# EAGLE design testbrd (EAGLE 6.6.0)
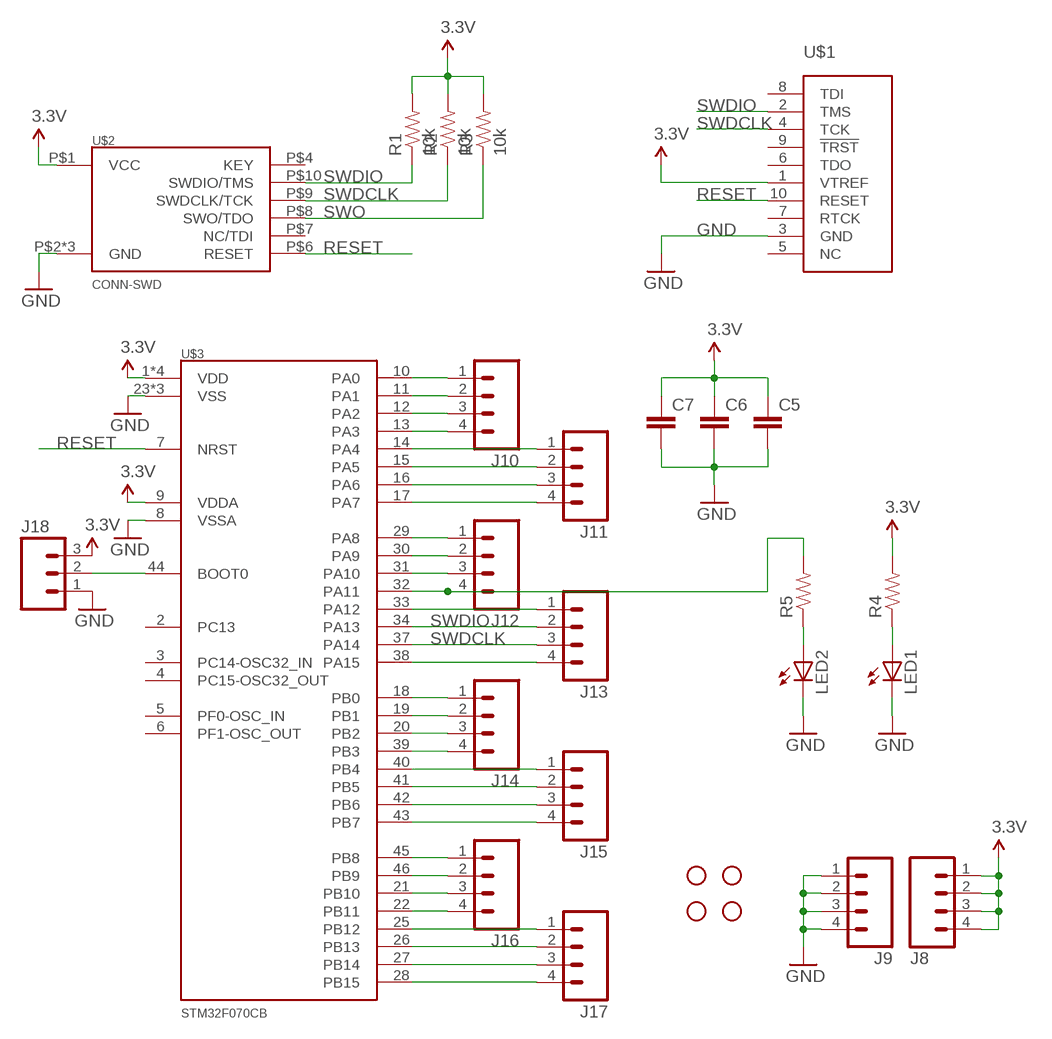
[diagram p0: schematic, sheet 1]

## Parts
C5  CAP0805  [0805]
C6  CAP0805  [0805]
C7  CAP0805  [0805]
H1  STAND-OFF  [STAND-OFF]
H2  STAND-OFF  [STAND-OFF]
H3  STAND-OFF  [STAND-OFF]
H4  STAND-OFF  [STAND-OFF]
J8  M04PTH  [1X04]
J9  M04PTH  [1X04]
J10  M04PTH  [1X04]
J11  M04PTH  [1X04]
J12  M04PTH  [1X04]
J13  M04PTH  [1X04]
J14  M04PTH  [1X04]
J15  M04PTH  [1X04]
J16  M04PTH  [1X04]
J17  M04PTH  [1X04]
J18  M03PTH  [1X03]
LED1  LEDCHIPLED_0805  [CHIPLED_0805]
LED2  LEDCHIPLED_0805  [CHIPLED_0805]
R1  10k  RESISTOR0805-RES  [0805]
R2  10k  RESISTOR0805-RES  [0805]
R3  10k  RESISTOR0805-RES  [0805]
R4  RESISTOR0805-RES  [0805]
R5  RESISTOR0805-RES  [0805]
U$1  TC2050-MCP-NL  [TC2050]
U$2  CONN-SWD  [CONN2X5]
U$3  STM32F070CB  [LQFP-48]

## Nets
3.3V: C5.1 C6.1 C7.1 J8.1 J8.2 J8.3 J8.4 J18.3 R1.2 R2.2 R3.2 R4.2 U$1.1(VTREF) U$2.P$1(VCC) U$3.1(VDD) U$3.9(VDDA) U$3.24(VDD) U$3.36(VDD) U$3.48(VDD)
GND: C5.2 C6.2 C7.2 J9.1 J9.2 J9.3 J9.4 J18.1 LED1.C LED2.C U$1.3(GND) U$2.P$2(GND) U$2.P$3(GND) U$2.P$5(GND) U$3.8(VSSA) U$3.23(VSS) U$3.35(VSS) U$3.47(VSS)
N$1: LED1.A R4.1
N$2: LED2.A R5.1
N$29: J18.2 U$3.44(BOOT0)
N$30: J10.1 U$3.10(PA0)
N$31: J10.2 U$3.11(PA1)
N$32: J10.3 U$3.12(PA2)
N$33: J10.4 U$3.13(PA3)
N$34: J11.1 U$3.14(PA4)
N$35: J11.2 U$3.15(PA5)
N$36: J11.3 U$3.16(PA6)
N$37: J11.4 U$3.17(PA7)
N$38: J12.1 U$3.29(PA8)
N$39: J12.2 U$3.30(PA9)
N$40: J12.3 U$3.31(PA10)
N$41: J12.4 R5.2 U$3.32(PA11)
N$42: J13.1 U$3.33(PA12)
N$45: J13.4 U$3.38(PA15)
N$46: J14.1 U$3.18(PB0)
N$47: J14.2 U$3.19(PB1)
N$48: J14.3 U$3.20(PB2)
N$49: J14.4 U$3.39(PB3)
N$50: J15.1 U$3.40(PB4)
N$51: J15.2 U$3.41(PB5)
N$52: J15.3 U$3.42(PB6)
N$53: J15.4 U$3.43(PB7)
N$54: J16.1 U$3.45(PB8)
N$55: J16.2 U$3.46(PB9)
N$56: J16.3 U$3.21(PB10)
N$57: J16.4 U$3.22(PB11)
N$58: J17.1 U$3.25(PB12)
N$59: J17.2 U$3.26(PB13)
N$60: J17.3 U$3.27(PB14)
N$61: J17.4 U$3.28(PB15)
RESET: U$1.10(RESET) U$2.P$6(RESET) U$3.7(NRST)
SWDCLK: J13.3 R2.1 U$1.4(TCK) U$2.P$9(SWDCLK/TCK) U$3.37(PA14)
SWDIO: J13.2 R1.1 U$1.2(TMS) U$2.P$10(SWDIO/TMS) U$3.34(PA13)
SWO: R3.1 U$2.P$8(SWO/TDO)
Unconnected: U$1.5(NC) U$1.6(TDO) U$1.7(RTCK) U$1.8(TDI) U$1.9(!TRST) U$2.P$4(KEY) U$2.P$7(NC/TDI) U$3.2(PC13) U$3.3(PC14-OSC32_IN) U$3.4(PC15-OSC32_OUT) U$3.5(PF0-OSC_IN) U$3.6(PF1-OSC_OUT)

## Library data of the parts
C5-C7 = SparkFun-Capacitors:CAP: Capacitor Standard 0603 ceramic capacitor, and 0.1" leaded capacitor.
H1-H4 = SparkFun-Electromechanical:STAND-OFF: #4 Stand Off This is the mechanical footprint for a #4 phillips button head screw. Use the keepout ring to avoid running the screw head into surrounding components. SKU : PRT-00447
J8-J17 = SparkFun-Connectors:M04: Header 4 Standard 4-pin 0.1" header. Use with straight break away headers (SKU : PRT-00116), right angle break away headers (PRT-00553), swiss pins (PRT-00743), machine pins (PRT-00117), and female headers (PRT-00115). Molex polarized connector foot print use with SKU : PRT-08231 with associated crimp pins and housings. 1MM SMD Version SKU: PRT-10208; PROD_ID: CONN-09696
J18 = SparkFun-Connectors:M03: Header 3 Standard 3-pin 0.1" header. Use with straight break away headers (SKU : PRT-00116), right angle break away headers (PRT-00553), swiss pins (PRT-00743), machine pins (PRT-00117), and female headers (PRT-00115). Molex polarized connector foot print use with SKU : PRT-08232 with associated crimp pins and housings.
LED1 LED2 = adafruit:LED: LED OSRAM: - CHIPLED LG R971, LG N971, LY N971, LG Q971, LY Q971, LO R971, LY R971 LH N974, LH R974 LS Q976, LO Q976, LY Q976 LO Q996 - Hyper CHIPLED LW Q18S LB Q993, LB Q99A, LB R99A - SideLED LS A670, LO A670, LY A670, LG A670, LP A670 LB A673, LV A673, LT A673, LW A673 LH A674 LY A675 LS A676, LA A676, LO A676, LY A676, LW A676 LS A679, LY A679, LG A679 - Hyper Micro SIDELED® LS Y876, LA Y876, LO Y876, LY Y876 LT Y87S - SmartLED LW L88C, LW L88S LB L89C, LB L89S, LG L890 LS L89K, LO L89K, LY L89K LS L896, LA L896, LO L896, LY L896 - TOPLED LS T670, LO T670, LY T670, LG T670, LP T670 LSG T670, LSP T670, LSY T670, LOP T670, LYG T670 LG T671, LOG T671, LSG T671 LB T673, LV T673, LT T673, LW T673 LH T674 LS T676, LA T676, LO T676, LY T676, LB T676, LH T676, LSB T676, LW T676 LB T67C, LV T67C, LT T67C, LS T67K, LO T67K, LY T67K, LW E67C LS E67B, LA E67B, LO E67B, LY E67B, LB E67C, LV E67C, LT E67C LW T67C LS T679, LY T679, LG T679 LS T770, LO T770, LY T770, LG T770, LP T770 LB T773, LV T773, LT T773, LW T773 LH T774 LS E675, LA E675, LY E675, LS T675 LS T776, LA T776, LO T776, LY T776, LB T776 LHGB T686 LT T68C, LB T68C - Hyper Mini TOPLED® LB M676 - Mini TOPLED Santana® LG M470 LS M47K, LO M47K, LY M47K Source: http://www.osram.convergy.de/
R1-R5 = SparkFun-Resistors:RESISTOR: Resistor Basic schematic elements and footprints for 0603, 1206, and PTH resistors.
U$1 = Connector:TC2050: TAG-CONNECT ISP Connector Manufacturer: Tag-Connect <www.tag-connect.com> Cable for easy In-Circuit PCB Programming. Designed for JTAG 10 pin, suitable for many others. Pin Connection for TC2050 NL. PAD Description 1 VTREF 2 TMS 3 GND 4 TCK 5 NC 6 TDO 7 RTCK 8 TDI 9 !TRST 10 RESET ©2009 ROFA.cz Modified 7/2011 by Tim McCarthy-Smith VIDA Products INC
U$2 = Atmel:CONN-SWD: 1.27mm pitch, 2x5 header for single wire debug / JTAG
U$3 = ST:STM32F070CB

## Board
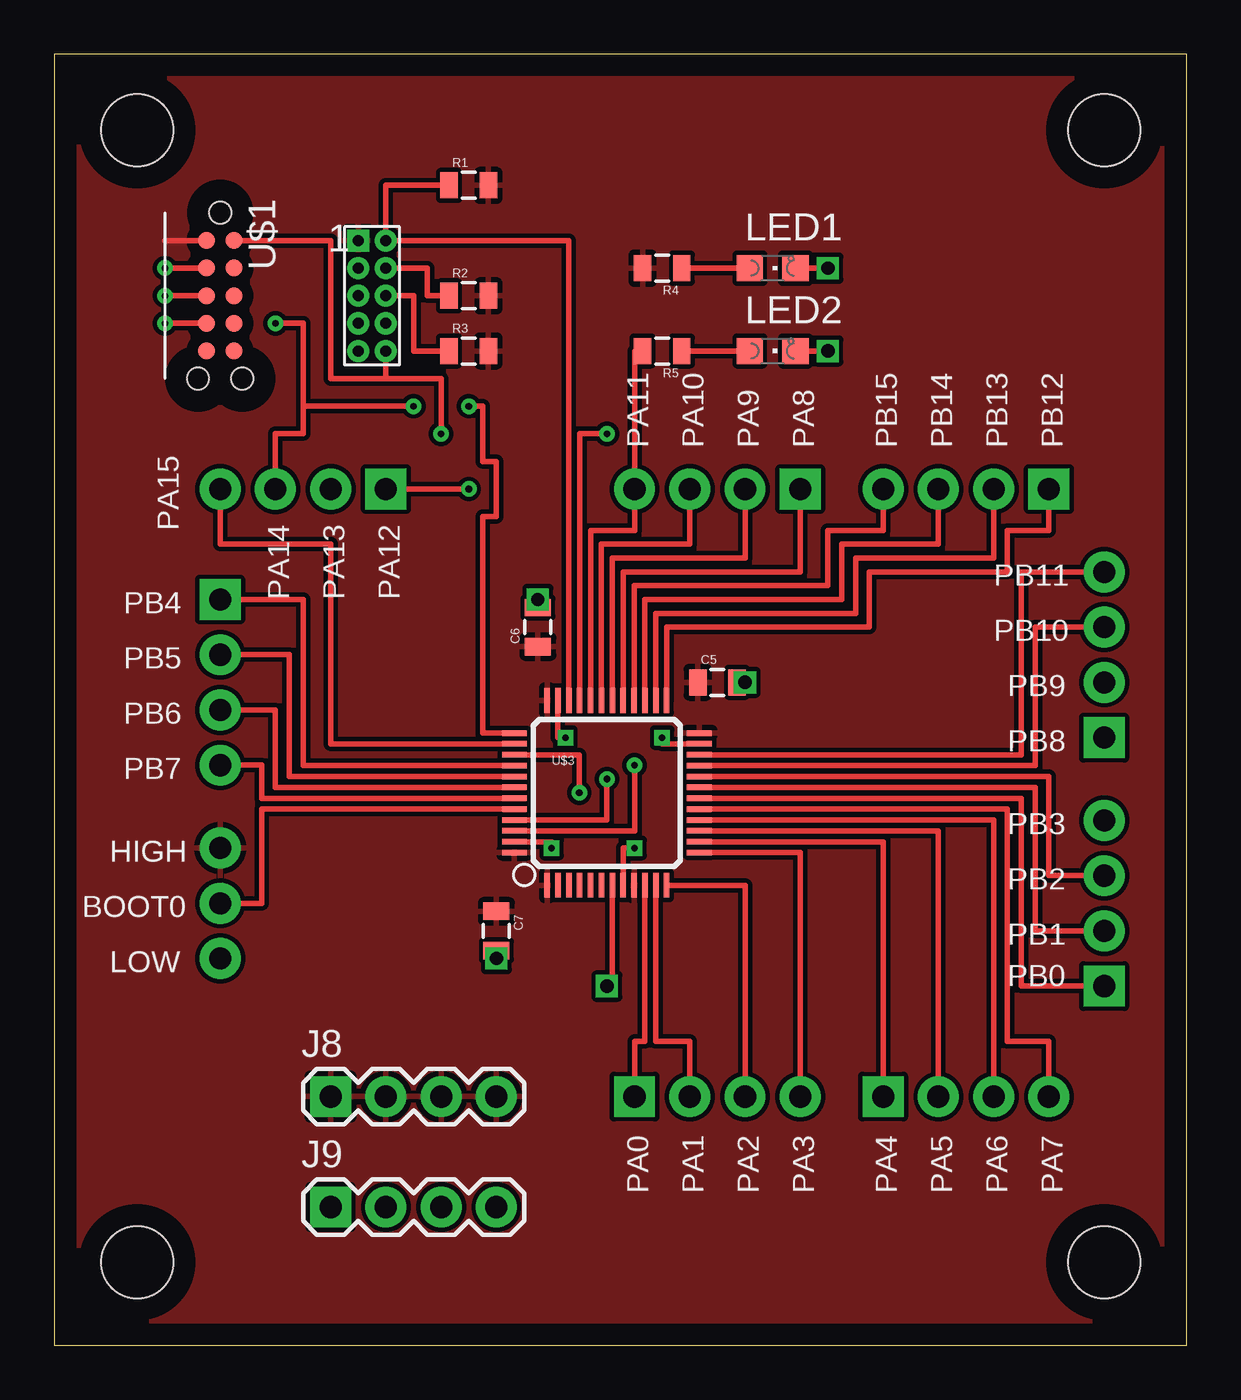
[diagram p1: board, top side]
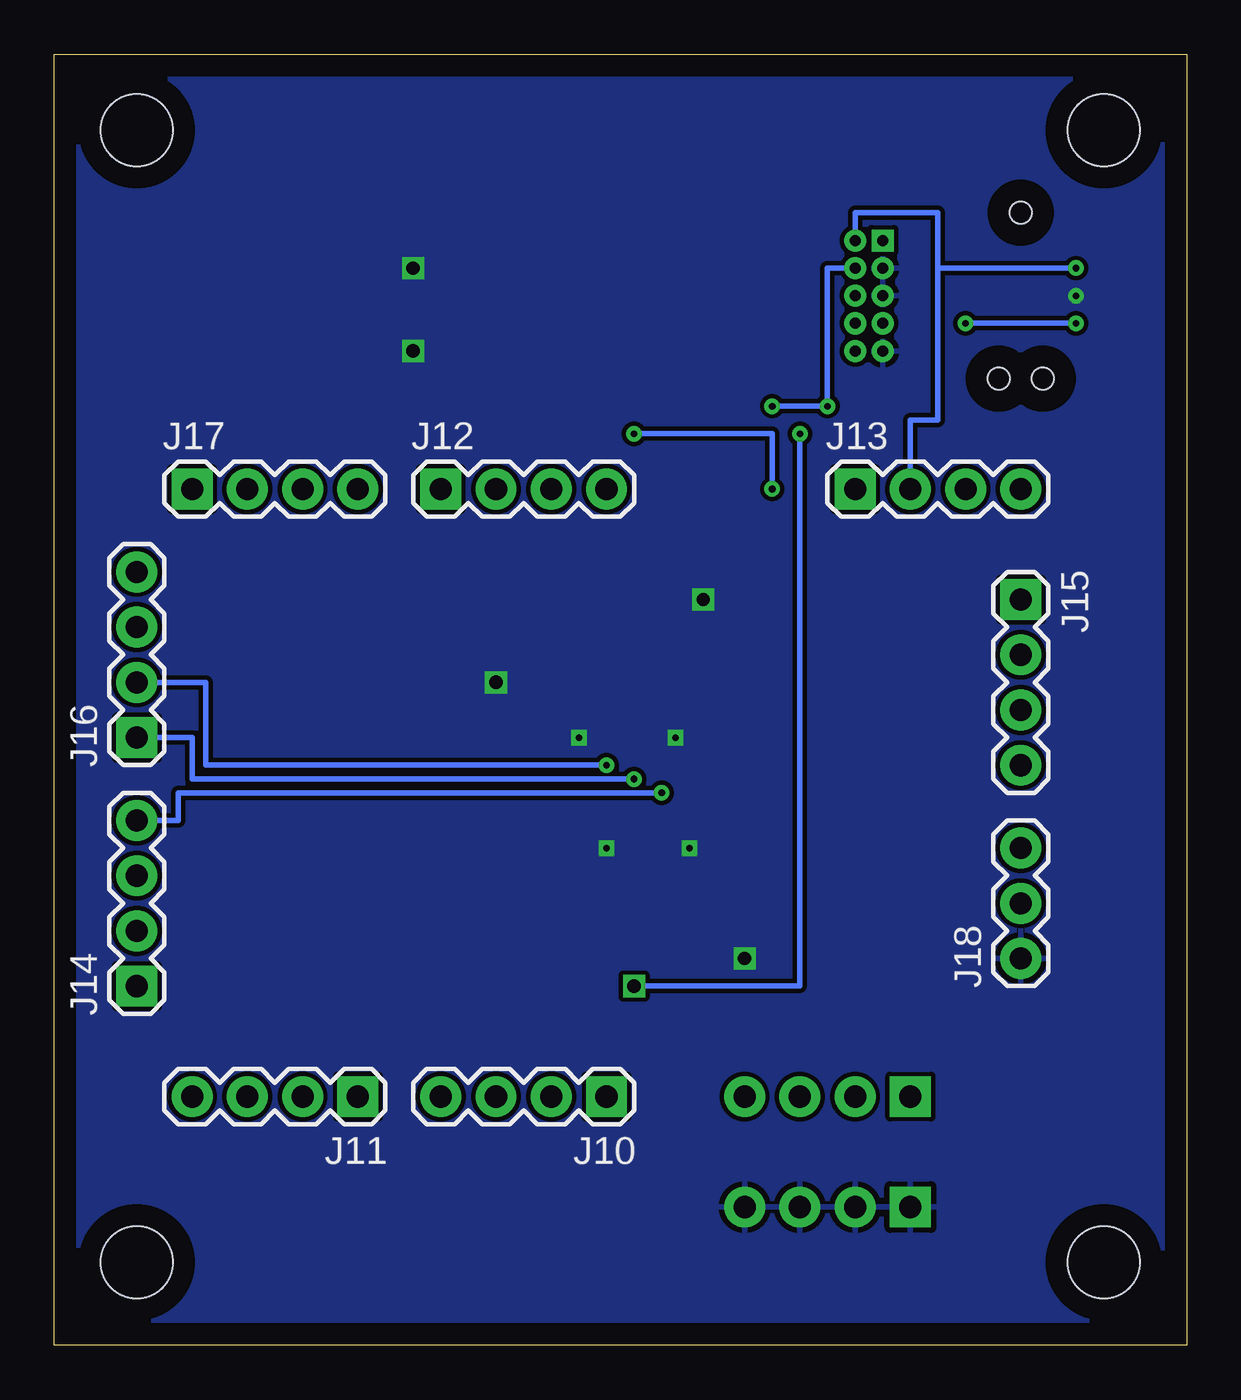
[diagram p2: board, bottom side, seen from below]

Size 52.05 x 59.36 mm. Coordinates in mm from the lower left corner, seen from the top.
Outline: 0,0 52.05,0 52.05,59.36 0,59.36 0,0
Copper layers (1*16): Top 0.035mm / dielectric 1.5mm / Bottom 0.035mm
Design rules "default *": minimum track width 10mil, minimum drill 12mil, track to track 8mil, track to pad 8mil, pad to pad 8mil, via to via 8mil, smd to smd 8mil, copper to edge 40mil, drill to drill 8mil, minimum pad ring 10mil, minimum via ring 8mil, stop-mask expansion 4mil, vias tented up to drill 0mil, thermal gap 10mil

### Footprints (pad centres in the part's own frame; a part is rotated, then mirrored left to right if it is on the bottom)
0805 = smd 0.8 x 1.2: 1 -0.9,0; 2 0.9,0
STAND-OFF = hole 3.302: 0,0
1X04 = drill 1.016 pad 1.88 square: 1 0,0 | drill 1.016 pad 1.88: 2 2.54,0; 3 5.08,0; 4 7.62,0
1X03 = drill 1.016 pad 1.88: 1 0,0; 2 2.54,0; 3 5.08,0
CHIPLED_0805 = smd 1.2 x 1.2: A 0,-1.05; C 0,1.05
TC2050 = smd 0.787 x 0.787: 1 1.27,-0.635; 2 2.54,-0.635; 3 3.81,-0.635; 4 5.08,-0.635; 5 6.35,-0.635; 6 6.35,0.635; 7 5.08,0.635; 8 3.81,0.635; 9 2.54,0.635; 10 1.27,0.635; 11 1.27,0.635; 12 1.27,0.635 | hole 1: 0,0; 7.62,-1.016; 7.62,1.016
CONN2X5 = drill 0.508 square: P$1 0,0 | drill 0.508: P$2 1.27,0; P$3 2.54,0; P$4 3.81,0; P$5 5.08,0; P$6 5.08,1.27; P$7 3.81,1.27; P$8 2.54,1.27; P$9 1.27,1.27; P$10 0,1.27
LQFP-48 = smd 0.254 x 1.143: 1 -2.75,-4.25; 2 -2.25,-4.25; 3 -1.75,-4.25; 4 -1.25,-4.25; 5 -0.75,-4.25; 6 -0.25,-4.25; 7 0.25,-4.25; 8 0.75,-4.25; 9 1.25,-4.25; 10 1.75,-4.25; 11 2.25,-4.25; 12 2.75,-4.25; 25 2.75,4.25; 26 2.25,4.25; 27 1.75,4.25; 28 1.25,4.25; 29 0.75,4.25; 30 0.25,4.25; 31 -0.25,4.25; 32 -0.75,4.25; 33 -1.25,4.25; 34 -1.75,4.25; 35 -2.25,4.25; 36 -2.75,4.25 | smd 1.143 x 0.254: 13 4.25,-2.75; 14 4.25,-2.25; 15 4.25,-1.75; 16 4.25,-1.25; 17 4.25,-0.75; 18 4.25,-0.25; 19 4.25,0.25; 20 4.25,0.75; 21 4.25,1.25; 22 4.25,1.75; 23 4.25,2.25; 24 4.25,2.75; 37 -4.25,2.75; 38 -4.25,2.25; 39 -4.25,1.75; 40 -4.25,1.25; 41 -4.25,0.75; 42 -4.25,0.25; 43 -4.25,-0.25; 44 -4.25,-0.75; 45 -4.25,-1.25; 46 -4.25,-1.75; 47 -4.25,-2.25; 48 -4.25,-2.75

### Placement (x,y rotation side)
C5  30.48,30.48 0 top
C6  22.23,33.02 90 top
C7  20.32,19.05 270 top
H1  48.26,3.81 0 top
H2  3.81,3.81 0 top
H3  3.81,55.88 0 top
H4  48.26,55.88 0 top
J8  12.7,11.43 0 top
J9  12.7,6.35 0 top
J10  26.67,11.43 180 bottom
J11  38.1,11.43 180 bottom
J12  34.29,39.37 0 bottom
J13  15.24,39.37 0 bottom
J14  48.26,16.51 90 bottom
J15  7.62,34.29 270 bottom
J16  48.26,27.94 90 bottom
J17  45.72,39.37 0 bottom
J18  7.62,17.78 90 bottom
LED1  33.02,49.53 270 top
LED2  33.02,45.72 270 top
R1  19.05,53.34 0 top
R2  19.05,48.26 0 top
R3  19.05,45.72 0 top
R4  27.94,49.53 180 top
R5  27.94,45.72 180 top
U$1  7.62,52.07 270 top
U$2  13.97,50.8 270 top
U$3  25.4,25.4 0 top

### Tracks (layer width: path | path; a pad name or v marks a point on that pad's centre or on a via)
3.3V
  Top 0.254: U$1.1 5.08,50.8
  pour Top: 0,0 52.07,0 52.07,59.69 0,59.69
GND  (via drill 0.3, 0.61)
  Top 0.254: U$1.3 v5.08,48.26 | C6.2 v22.23,34.29 | v31.75,30.48 C5.2 | v20.32,17.78 C7.2 | v23.5,27.94 23.15,27.94 U$3.35 | U$3.23 27.94,27.65 v27.94,27.94 | U$3.47 22.86,23.15 v22.86,22.86 | v26.67,22.86 26.15,22.86 U$3.8 | LED2.C v35.56,45.72 | LED1.C v35.56,49.53
  pour Bottom: 0,0 52.07,0 52.07,59.69 0,59.69
N$1
  Top 0.254: LED1.A R4.1
N$2
  Top 0.254: R5.1 LED2.A
N$29
  Top 0.254: U$3.44 9.53,24.65 9.53,20.32 J18.2
N$30
  Top 0.254: U$3.10 27.15,13.97 26.67,13.97 J10.1
N$31
  Top 0.254: U$3.11 27.65,13.97 29.21,13.97 J10.2
N$32
  Top 0.254: U$3.12 31.75,21.15 J10.3
N$33
  Top 0.254: U$3.13 34.29,22.65 J10.4
N$34
  Top 0.254: U$3.14 38.1,23.15 J11.1
N$35
  Top 0.254: U$3.15 40.64,23.65 J11.2
N$36
  Top 0.254: U$3.16 43.18,24.15 J11.3
N$37
  Top 0.254: U$3.17 43.81,24.65 43.81,13.97 45.72,13.97 J11.4
N$38
  Top 0.254: U$3.29 26.15,35.56 34.29,35.56 J12.1
N$39
  Top 0.254: U$3.30 25.65,36.2 31.75,36.2 J12.2
N$40
  Top 0.254: U$3.31 25.15,36.83 29.21,36.83 J12.3
N$41
  Top 0.254: U$3.32 24.65,37.47 26.67,37.47 J12.4 26.67,45.72 R5.2
N$42  (via drill 0.3)
  Top 0.254: U$3.33 24.15,41.91 v25.4,41.91 | v19.05,39.37 J13.1
  Bottom 0.254: v25.4,41.91 19.05,41.91 v19.05,39.37
N$45
  Top 0.254: U$3.38 12.7,27.65 12.7,36.83 7.62,36.83 J13.4
N$46
  Top 0.254: U$3.18 44.45,25.15 44.45,16.51 J14.1
N$47
  Top 0.254: U$3.19 45.09,25.65 45.09,19.05 J14.2
N$48
  Top 0.254: U$3.20 45.72,26.15 45.72,21.59 J14.3
N$49  (via drill 0.3)
  Top 0.254: U$3.39 24.13,27.15 v24.13,25.4
  Bottom 0.254: v24.13,25.4 46.35,25.4 46.35,24.13 J14.4
N$50
  Top 0.254: U$3.40 11.43,26.65 11.43,34.29 J15.1
N$51
  Top 0.254: U$3.41 10.79,26.15 10.79,31.75 J15.2
N$52
  Top 0.254: U$3.42 10.16,25.65 10.16,29.21 J15.3
N$53
  Top 0.254: U$3.43 9.53,25.15 9.53,26.67 J15.4
N$54  (via drill 0.3)
  Top 0.254: U$3.45 25.4,24.15 v25.4,26.04
  Bottom 0.254: v25.4,26.04 45.72,26.04 45.72,27.94 J16.1
N$55  (via drill 0.3)
  Top 0.254: U$3.46 26.67,23.65 v26.67,26.67
  Bottom 0.254: v26.67,26.67 45.09,26.67 45.09,30.48 J16.2
N$56
  Top 0.254: U$3.21 45.09,26.65 45.09,33.02 J16.3
N$57
  Top 0.254: U$3.22 44.45,27.15 44.45,35.56 J16.4
N$58
  Top 0.254: U$3.25 28.15,33.02 37.47,33.02 37.47,35.56 43.81,35.56 43.81,37.47 45.72,37.47 J17.1
N$59
  Top 0.254: U$3.26 27.65,33.66 36.83,33.66 36.83,36.2 43.18,36.2 J17.2
N$60
  Top 0.254: U$3.27 27.15,34.29 36.2,34.29 36.2,36.83 40.64,36.83 J17.3
N$61
  Top 0.254: U$3.28 26.65,34.92 35.56,34.92 35.56,37.47 38.1,37.47 J17.4
RESET  (via drill 0.3, 0.61)
  Top 0.254: U$1.10 12.7,50.8 12.7,44.45 15.24,44.45 | 15.24,44.45 U$2.P$6 | 15.24,44.45 17.78,44.45 v17.78,41.91 | U$3.7 25.65,16.51 v25.4,16.51
  Bottom 0.254: v25.4,16.51 17.78,16.51 v17.78,41.91
SWDCLK  (via drill 0.3)
  Top 0.254: U$1.4 v5.08,46.99 | v10.16,46.99 11.43,46.99 11.43,43.18 | 11.43,43.18 v16.51,43.18 | R2.1 17.14,48.26 17.14,49.53 U$2.P$9 | v19.05,43.18 19.68,43.18 19.68,40.64 20.32,40.64 20.32,38.1 19.68,38.1 19.68,28.15 U$3.37 | 11.43,43.18 11.43,41.91 10.16,41.91 J13.3
  Bottom 0.254: v5.08,46.99 v10.16,46.99 | U$2.P$9 16.51,49.53 v16.51,43.18 v19.05,43.18
SWDIO  (via drill 0.3)
  Top 0.254: U$1.2 v5.08,49.53 | R1.1 15.24,53.34 U$2.P$10 23.65,50.8 U$3.34
  Bottom 0.254: v5.08,49.53 11.43,49.53 | 11.43,49.53 11.43,52.07 15.24,52.07 U$2.P$10 | 11.43,49.53 11.43,42.55 12.7,42.55 J13.2
SWO
  Top 0.254: U$2.P$8 16.51,48.26 16.51,45.72 R3.1

### Text on the board
tPlace: PA11 | PA10 | PA9 | PA8 | PB15 | PB14 | PB13 | PB12 | PA15 | PB11 | PB4 | PA14 | PA13 | PA12 | PB10 | PB5 | PB9 | PB6 | PB8 | PB7 | PB3 | HIGH | PB2 | BOOT0 | PB1 | LOW | PB0 | PA0 | PA1 | PA2 | PA3 | PA4 | PA5 | PA6 | PA7